# EAGLE schematic CleanSensorBoard (EAGLE 5.07)
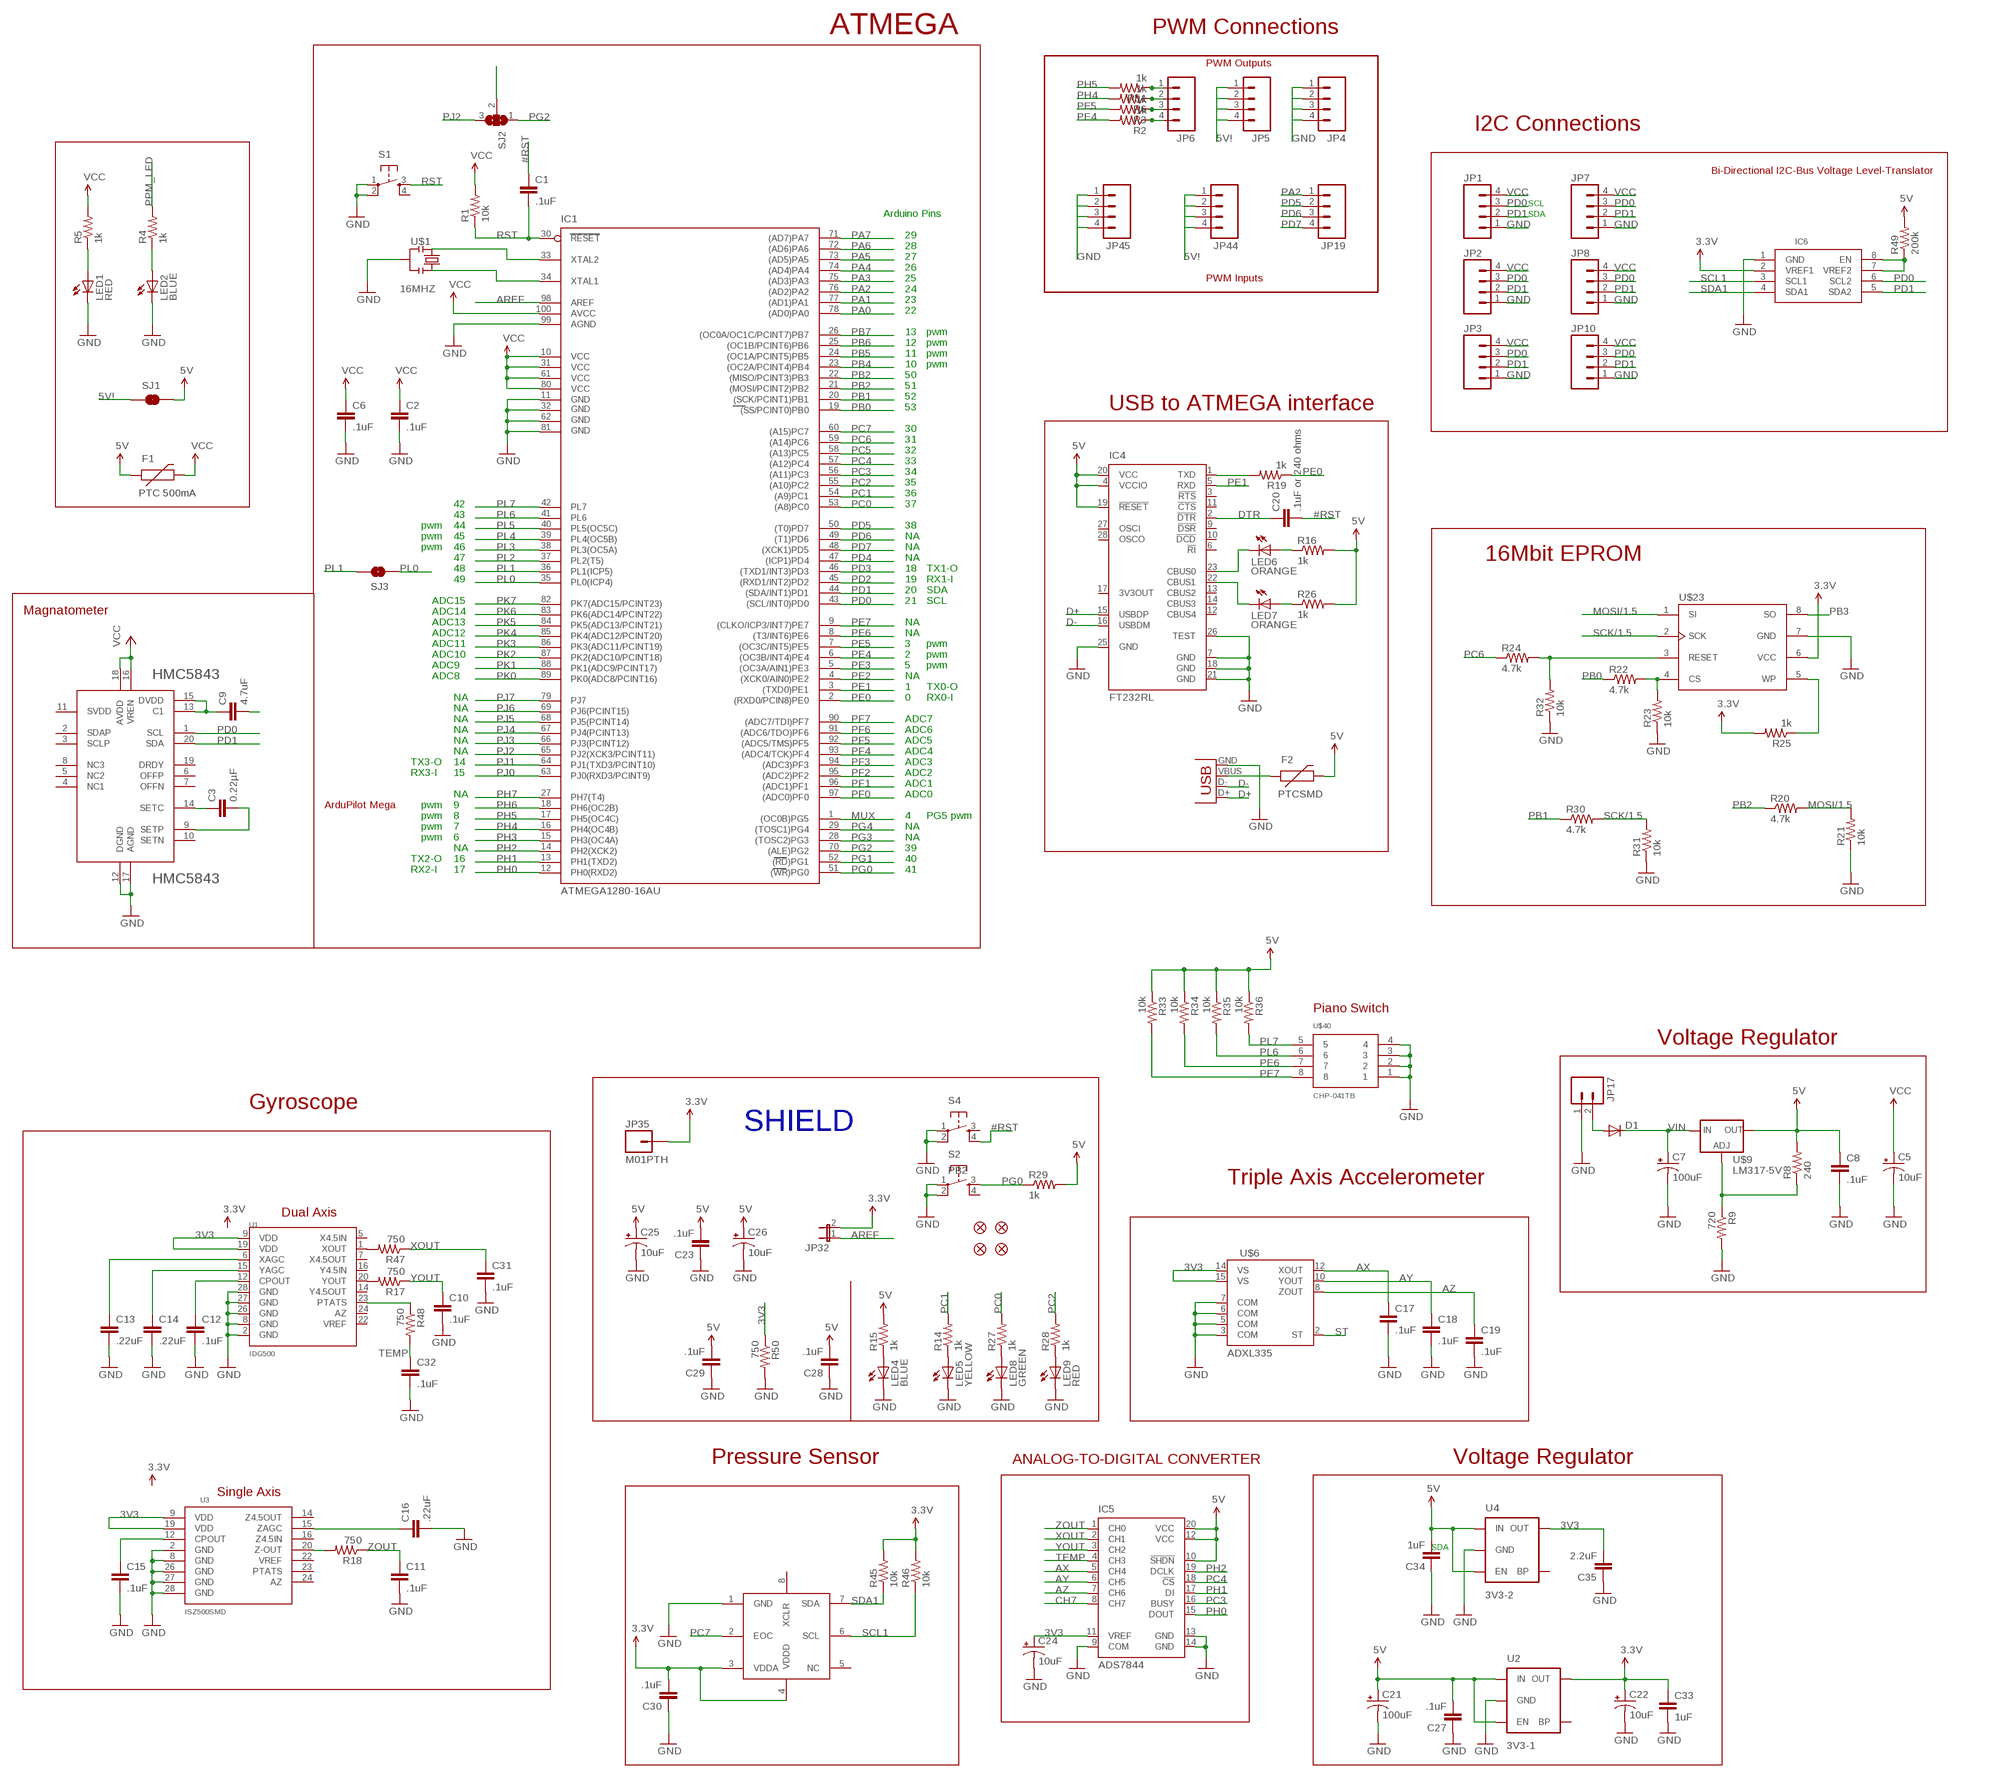
[diagram p0: schematic, sheet 1]

## Parts
C1  .1uF  CAP0402  [C0402]
C2  .1uF  CAP0402  [C0402]
C3  0.22µF  C-EUC0402  [C0402]
C5  10uF  CAP_POL1206  [EIA3216]
C6  .1uF  CAP0402  [C0402]
C7  100uF  CAP_POL3528  [EIA3528]
C8  .1uF  CAP0402  [C0402]
C9  4.7uF  CAP0402  [C0402]
C10  .1uF  CAP0402  [C0402]
C11  .1uF  CAP0402  [C0402]
C12  .1uF  CAP0402  [C0402]
C13  .22uF  CAP0402  [C0402]
C14  .22uF  CAP0402  [C0402]
C15  .1uF  CAP0402  [C0402]
C16  .22uF  CAP0402  [C0402]
C17  .1uF  CAP0402  [C0402]
C18  .1uF  CAP0402  [C0402]
C19  .1uF  CAP0402  [C0402]
C20  .1uF or 240 ohms  CAP0402  [C0402]
C21  100uF  CAP_POL3528  [EIA3528]
C22  10uF  CAP_POL1206  [EIA3216]
C23  .1uF  CAP0402  [C0402]
C24  10uF  CAP_POL1206  [EIA3216]
C25  10uF  CAP_POL1206  [EIA3216]
C26  10uF  CAP_POL1206  [EIA3216]
C27  .1uF  CAP0402  [C0402]
C28  .1uF  CAP0402  [C0402]
C29  .1uF  CAP0402  [C0402]
C30  .1uF  CAP0402  [C0402]
C31  .1uF  CAP0402  [C0402]
C32  .1uF  CAP0402  [C0402]
C33  1uF  CAP0402  [C0402]
C34  1uF  CAP0402  [C0402]
C35  2.2uF  CAP0402  [C0402]
D1  DIODESMA  [SMA-DIODE]
F1  PTC 500mA  PTCSMD  [PTC-1206]
F2  PTCSMD  [PTC-1206]
HMC5843  HMC5843  [LPCC-20]
IC1  ATMEGA1280-16AU  [TQFP100]
IC4  FT232RL  [SSOP28]
IC5  ADS7844  ADS8344U  [SSOP20BU]
IC6  PCA9306  [SOIC8]
JP1  M04PTH  [1X04]
JP2  M04PTH  [1X04]
JP3  M04PTH  [1X04]
JP4  M04PTH  [1X04]
JP5  M04PTH  [1X04]
JP6  M04PTH  [1X04]
JP7  M04PTH  [1X04]
JP8  M04PTH  [1X04]
JP9  FIDUCIAL1.5X3  [FIDUCIAL-1.5X3]
JP10  M04PTH  [1X04]
JP17  M02NG  [1X02]
JP19  M04PTH  [1X04]
JP32  JUMPER-2SMD-NO  [SJ_2S-NO]
JP35  M01PTH  [1X01]
JP41  FIDUCIAL1.5X3  [FIDUCIAL-1.5X3]
JP42  FIDUCIAL1.5X3  [FIDUCIAL-1.5X3]
JP43  FIDUCIAL1.5X3  [FIDUCIAL-1.5X3]
JP44  M04PTH  [1X04]
JP45  M04PTH  [1X04]
LED1  RED  LED0603  [LED-0603]
LED2  BLUE  LED0603  [LED-0603]
LED4  BLUE  LED0603  [LED-0603]
LED5  YELLOW  LED0603  [LED-0603]
LED6  ORANGE  LED0603  [LED-0603]
LED7  ORANGE  LED0603  [LED-0603]
LED8  GREEN  LED0603  [LED-0603]
LED9  RED  LED0603  [LED-0603]
R1  10k  RESISTOR0402  [C0402]
R2  1k  RESISTOR0402  [C0402]
R3  1k  RESISTOR0402  [C0402]
R4  1k  RESISTOR0402  [C0402]
R5  1k  RESISTOR0402  [C0402]
R6  1k  RESISTOR0402  [C0402]
R8  240  RESISTOR0402  [C0402]
R9  720  RESISTOR0402  [C0402]
R14  1k  RESISTOR0402  [C0402]
R15  1k  RESISTOR0402  [C0402]
R16  1k  RESISTOR0402  [C0402]
R17  750  RESISTOR0402  [C0402]
R18  750  RESISTOR0402  [C0402]
R19  1k  RESISTOR0402  [C0402]
R20  4.7k  RESISTOR0402  [C0402]
R21  10k  RESISTOR0402  [C0402]
R22  4.7k  RESISTOR0402  [C0402]
R23  10k  RESISTOR0402  [C0402]
R24  4.7k  RESISTOR0402  [C0402]
R25  1k  RESISTOR0402  [C0402]
R26  1k  RESISTOR0402  [C0402]
R27  1k  RESISTOR0402  [C0402]
R28  1k  RESISTOR0402  [C0402]
R29  1k  RESISTOR0402  [C0402]
R30  4.7k  RESISTOR0402  [C0402]
R31  10k  RESISTOR0402  [C0402]
R32  10k  RESISTOR0402  [C0402]
R33  10k  RESISTOR0402  [C0402]
R34  10k  RESISTOR0402  [C0402]
R35  10k  RESISTOR0402  [C0402]
R36  10k  RESISTOR0402  [C0402]
R45  10k  RESISTOR0402  [C0402]
R46  10k  RESISTOR0402  [C0402]
R47  750  RESISTOR0402  [C0402]
R48  750  RESISTOR0402  [C0402]
R49  200k  RESISTOR0402  [C0402]
R50  750  RESISTOR0402  [C0402]
R51  1k  RESISTOR0402  [C0402]
S1  TAC_SWITCHSMD  [TACTILE_SWITCH_SMD]
S2  TAC_SWITCHSMD  [TACTILE_SWITCH_SMD]
S4  TAC_SWITCHSMD  [TACTILE_SWITCH_SMD]
SJ1  SJ2  SOLDERJUMPERNC2  [SJ_2S]
SJ2  SOLDERJUMPER_2WAYS  [SJ_3]
SJ3  SOLDERJUMPERNC3  [SJ_2S-NOTRACE]
U1  IDG500  [SPARKFUN_IDG500]
U2  3V3-1  V_REG_LDOSMD  [SOT23-5]
U3  ISZ500SMD  [QFN-28_6X8]
U4  3V3-2  V_REG_LDOSMD  [SOT23-5]
U$1  16MHZ  RESONATORSMD  [RESONATOR-SMD]
U$6  ADXL335  ADXL330SMD  [LFCSP-16]
U$9  LM317-5V  V_REG_317SMD  [SOT223]
U$23  DF  ATMEL_DATA_FLASH  [SO08WIDE]
U$40  CHP-041TB  [CHP-041TB]
U$41  BMP085  [BMP085]
X1  USBSMD  [USB-MINIB]

## Nets
3.3V: C22.A(+) C30.2 C33.1 IC6.2(VREF1) JP32.2 JP35.1 R25.2 R45.2 R46.2 U2.5(OUT) U$23.6(VCC) U$41.3(VDDA) U$41.4(VDDD)
3V3: C24.A(+) C35.2 IC5.11(VREF) R50.1 U1.9(VDD) U1.19(VDD) U3.9(VDD) U3.19(VDD) U4.5(OUT) U$6.14(VS) U$6.15(VS)
5V: F2.2
5V!: JP5.1 JP5.2 JP5.3 JP5.4 JP44.1 JP44.2 JP44.3 JP44.4 SJ1.1
#RST: C1.1 C20.2 S4.4
AREF: IC1.98(AREF) JP32.1
AX: C17.1 IC5.5(CH4) U$6.12(XOUT)
AY: C18.1 IC5.6(CH5) U$6.10(YOUT)
AZ: C19.1 IC5.7(CH6) U$6.8(ZOUT)
CH7: IC5.8(CH7)
D+: IC4.15(USBDP) X1.D+
D-: IC4.16(USBDM) X1.D-
DTR: C20.1 IC4.2(!DTR)
DVDD: C9.1 HMC5843.13(C1) HMC5843.15(DVDD)
GND: C2.2 C5.C(-) C6.2 C7.C(-) C8.2 C9.2 C10.2 C11.2 C12.2 C13.2 C14.2 C15.2 C16.2 C17.2 C18.2 C19.2 C21.C(-) C22.C(-) C23.1 C24.C(-) C25.C(-) C26.C(-) C27.1 C28.1 C29.1 C30.1 C31.2 C32.2 C33.2 C34.1 C35.1 HMC5843.12(DGND) HMC5843.17(AGND) IC1.11(GND) IC1.32(GND1) IC1.62(GND2) IC1.81(GND3) IC1.99(AGND) IC4.7(GND) IC4.18(GND) IC4.21(GND) IC4.25(GND) IC4.26(TEST) IC5.9(COM) IC5.13(GND) IC5.14(GND) IC6.1(GND) JP1.1 JP2.1 JP3.1 JP4.1 JP4.2 JP4.3 JP4.4 JP7.1 JP8.1 JP10.1 JP17.1 JP45.1 JP45.2 JP45.3 JP45.4 LED1.C LED2.C LED4.C LED5.C LED8.C LED9.C R9.2 R21.1 R23.1 R31.1 R32.1 R50.2 S1.1 S1.2 S2.1 S2.2 S4.1 S4.2 U1.2(GND) U1.8(GND) U1.26(GND) U1.27(GND) U1.28(GND) U2.2(GND) U3.2(GND) U3.8(GND) U3.26(GND) U3.27(GND) U3.28(GND) U4.2(GND) U$1.2 U$6.3(COM) U$6.5(COM) U$6.6(COM) U$6.7(COM) U$23.7(GND) U$40.1 U$40.2 U$40.3 U$40.4 U$41.1(GND) X1.GND
MOSI/1.5: R20.2 R21.2 U$23.1(SI)
MUX: IC1.1((OC0B)PG5)
N$1: LED1.A R5.1
N$2: LED2.A R4.1
N$3: R8.1 R9.1 U$9.1(ADJ)
N$4: D1.A JP17.2
N$6: JP6.1 R51.1
N$7: JP6.2 R6.1
N$11: C3.1 HMC5843.14(SETC)
N$12: SJ2.2
N$13: LED4.A R15.1
N$14: LED5.A R14.1
N$15: LED6.A R16.1
N$16: IC4.1(TXD) R19.2
N$17: F2.1 X1.VBUS
N$18: R22.2 R23.2 U$23.4(CS)
N$19: R24.2 R32.2 U$23.3(RESET)
N$20: C3.2 HMC5843.9(SETP)
N$22: LED7.A R26.1
N$23: R17.2 U1.20(YOUT)
N$24: IC4.23(CBUS0) LED6.C
N$25: IC4.22(CBUS1) LED7.C
N$26: LED8.A R27.1
N$27: LED9.A R28.1
N$29: R47.2 U1.1(XOUT)
N$30: C12.1 U1.12(CPOUT)
N$31: C13.1 U1.6(XAGC)
N$32: C14.1 U1.15(YAGC)
N$33: C15.1 U3.12(CPOUT)
N$35: C16.1 U3.15(ZAGC)
N$37: R48.1 U1.23(PTATS)
N$39: R18.2 U3.20(Z-OUT)
N$41: IC6.7(VREF2) IC6.8(EN) R49.1
N$42: JP6.3 R3.1
N$43: JP6.4 R2.1
N$56: IC1.34(XTAL1) U$1.3
N$89: IC1.33(XTAL2) U$1.1
PA0: IC1.78((AD0)PA0)
PA1: IC1.77((AD1)PA1)
PA2: IC1.76((AD2)PA2) JP19.1
PA3: IC1.75((AD3)PA3)
PA4: IC1.74((AD4)PA4)
PA5: IC1.73((AD5)PA5)
PA6: IC1.72((AD6)PA6)
PA7: IC1.71((AD7)PA7)
PB0: IC1.19((SS/PCINT0)PB0) R22.1
PB1: IC1.20((SCK/PCINT1)PB1) R30.1
PB2: IC1.21((MOSI/PCINT2)PB2) IC1.22((MISO/PCINT3)PB3) R20.1
PB3: U$23.8(SO)
PB4: IC1.23((OC2A/PCINT4)PB4)
PB5: IC1.24((OC1A/PCINT5)PB5)
PB6: IC1.25((OC1B/PCINT6)PB6)
PB7: IC1.26((OC0A/OC1C/PCINT7)PB7)
PC0: IC1.53((A8)PC0) R27.2
PC1: IC1.54((A9)PC1) R14.2
PC2: IC1.55((A10)PC2) R28.2
PC3: IC1.56((A11)PC3) IC5.16(BUSY)
PC4: IC1.57((A12)PC4) IC5.18(!CS)
PC5: IC1.58((A13)PC5)
PC6: IC1.59((A14)PC6) R24.1
PC7: IC1.60((A15)PC7) U$41.2(EOC)
PD0: HMC5843.1(SCL) IC1.43((SCL/INT0)PD0) IC6.6(SCL2) JP1.3 JP2.3 JP3.3 JP7.3 JP8.3 JP10.3
PD1: HMC5843.20(SDA) IC1.44((SDA/INT1)PD1) IC6.5(SDA2) JP1.2 JP2.2 JP3.2 JP7.2 JP8.2 JP10.2
PD2: IC1.45((RXD1/INT2)PD2)
PD3: IC1.46((TXD1/INT3)PD3)
PD4: IC1.47((ICP1)PD4)
PD5: IC1.50((T0)PD7) JP19.2
PD6: IC1.49((T1)PD6) JP19.3
PD7: IC1.48((XCK1)PD5) JP19.4
PE0: IC1.2((RXD0/PCIN8)PE0) R19.1
PE1: IC1.3((TXD0)PE1) IC4.5(RXD)
PE2: IC1.4((XCK0/AIN0)PE2)
PE3: IC1.5((OC3A/AIN1)PE3)
PE4: IC1.6((OC3B/INT4)PE4) R2.2
PE5: IC1.7((OC3C/INT5)PE5) R3.2
PE6: IC1.8((T3/INT6)PE6) R34.2 U$40.7
PE7: IC1.9((CLKO/ICP3/INT7)PE7) R33.2 U$40.8
PF0: IC1.97((ADC0)PF0)
PF1: IC1.96((ADC1)PF1)
PF2: IC1.95((ADC2)PF2)
PF3: IC1.94((ADC3)PF3)
PF4: IC1.93((ADC4/TCK)PF4)
PF5: IC1.92((ADC5/TMS)PF5)
PF6: IC1.91((ADC6/TDO)PF6)
PF7: IC1.90((ADC7/TDI)PF7)
PG0: IC1.51((WR)PG0) R29.1 S2.3
PG1: IC1.52((RD)PG1)
PG2: IC1.70((ALE)PG2) SJ2.1
PG3: IC1.28((TOSC2)PG3)
PG4: IC1.29((TOSC1)PG4)
PH0: IC1.12(PH0(RXD2)) IC5.15(DOUT)
PH1: IC1.13(PH1(TXD2)) IC5.17(DI)
PH2: IC1.14(PH2(XCK2)) IC5.19(DCLK)
PH3: IC1.15(PH3(OC4A))
PH4: IC1.16(PH4(OC4B)) R6.2
PH5: IC1.17(PH5(OC4C)) R51.2
PH6: IC1.18(PH6(OC2B))
PH7: IC1.27(PH7(T4))
PJ0: IC1.63(PJ0(RXD3/PCINT9))
PJ1: IC1.64(PJ1(TXD3/PCINT10))
PJ2: IC1.65(PJ2(XCK3/PCINT11)) SJ2.3
PJ3: IC1.66(PJ3(PCINT12))
PJ4: IC1.67(PJ4(PCINT13))
PJ5: IC1.68(PJ5(PCINT14))
PJ6: IC1.69(PJ6(PCINT15))
PJ7: IC1.79(PJ7)
PK0: IC1.89(PK0(ADC8/PCINT16))
PK1: IC1.88(PK1(ADC9/PCINT17))
PK2: IC1.87(PK2(ADC10/PCINT18))
PK3: IC1.86(PK3(ADC11/PCINT19))
PK4: IC1.85(PK4(ADC12/PCINT20))
PK5: IC1.84(PK5(ADC13/PCINT21))
PK6: IC1.83(PK6(ADC14/PCINT22))
PK7: IC1.82(PK7(ADC15/PCINT23))
PL0: IC1.35(PL0(ICP4)) SJ3.1
PL1: IC1.36(PL1(ICP5)) SJ3.2
PL2: IC1.37(PL2(T5))
PL3: IC1.38(PL3(OC5A))
PL4: IC1.39(PL4(OC5B))
PL5: IC1.40(PL5(OC5C))
PL6: IC1.41(PL6) R35.2 U$40.6
PL7: IC1.42(PL7) R36.2 U$40.5
PPM_LED: R4.2
RST: C1.2 IC1.30(RESET) R1.1 S1.3
SCK/1.5: R30.2 R31.2 U$23.2(SCK)
SCL1: IC6.3(SCL1) R46.1 U$41.6(SCL)
SDA1: IC6.4(SDA1) R45.1 U$41.7(SDA)
ST: U$6.2(ST)
TEMP: C32.1 IC5.4(CH3) R48.2
VCC: C2.1 C5.A(+) C6.1 C8.1 C21.A(+) C23.2 C25.A(+) C26.A(+) C27.2 C28.2 C29.2 C34.2 F1.1 F1.2 HMC5843.16(VREN) HMC5843.18(AVDD) IC1.10(VCC) IC1.31(VCC1) IC1.61(VCC2) IC1.80(VCC3) IC1.100(AVCC) IC4.4(VCCIO) IC4.19(!RESET) IC4.20(VCC) IC5.10(!SHDN) IC5.12(VCC) IC5.20(VCC) JP1.4 JP2.4 JP3.4 JP7.4 JP8.4 JP10.4 R1.2 R5.2 R8.2 R15.2 R16.2 R26.2 R29.2 R33.1 R34.1 R35.1 R36.1 R49.2 SJ1.2 U2.1(IN) U2.3(EN) U4.1(IN) U4.3(EN) U$9.2(OUT) ; supply symbol labelled 5V
VIN: C7.A(+) D1.C U$9.3(IN)
WP: R25.1 U$23.5(WP)
XOUT: C31.1 IC5.2(CH1) R47.1
YOUT: C10.1 IC5.3(CH2) R17.1
ZOUT: C11.1 IC5.1(CH0) R18.1
Unconnected: HMC5843.2(SDAP) HMC5843.3(SCLP) HMC5843.4(NC1) HMC5843.5(NC2) HMC5843.6(OFFP) HMC5843.7(OFFN) HMC5843.8(NC3) HMC5843.10(SETN) HMC5843.11(SVDD) HMC5843.19(DRDY) IC4.3(!RTS) IC4.6(!RI) IC4.9(!DSR) IC4.10(!DCD) IC4.11(!CTS) IC4.12(CBUS4) IC4.13(CBUS2) IC4.14(CBUS3) IC4.17(3V3OUT) IC4.27(OSCI) IC4.28(OSCO) S1.4 S2.4 S4.3 U1.5(X4.5IN) U1.7(X4.5OUT) U1.14(Y4.5OUT) U1.16(Y4.5IN) U1.22(VREF) U1.24(AZ) U2.4(BP) U3.14(Z4.5OUT) U3.16(Z4.5IN) U3.22(VREF) U3.23(PTATS) U3.24(AZ) U4.4(BP) U$41.5(NC) U$41.8(XCLR)

## Notes on the sheet
- ATMEGA | PWM Connections
- PWM Outputs
- I2C Connections
- Bi-Directional I2C-Bus Voltage Level-Translator
- SCL
- Arduino Pins | SDA
- 29
- 28
- 27
- 26
- 25 | PWM Inputs
- 24
- 23
- 22
- 13 | pwm
- 12 | pwm
- 11 | pwm
- 10 | pwm
- 50
- 51
- 52
- 53 | USB to ATMEGA interface
- 30
- 31
- 32
- 33
- 34
- 35
- 36
- 42 | 37
- 43
- pwm | 44 | 38
- pwm | 45 | NA
- pwm | 46 | NA
- 47 | NA | 16Mbit EPROM
- 48 | 18 | TX1-O
- 49 | 19 | RX1-I
- 20 | SDA
- ADC15 | 21 | SCL
- Magnatometer | ADC14
- ADC13 | NA
- ADC12 | NA
- ADC11 | 3 | pwm
- ADC10 | 2 | pwm
- ADC9 | 5 | pwm
- ADC8 | NA
- 1 | TX0-O
- NA | 0 | RX0-I
- NA
- NA | ADC7
- SCL | NA | ADC6
- SDA | NA | ADC5
- NA | ADC4
- TX3-O | 14 | ADC3
- RX3-I | 15 | ADC2
- ADC1
- NA | ADC0
- ArduPilot Mega | pwm | 9
- pwm | 8 | 4 | PG5 pwm
- pwm | 7 | NA
- pwm | 6 | NA
- NA | 39
- TX2-O | 16 | 40
- RX2-I | 17 | 41
- Piano Switch
- Voltage Regulator
- Gyroscope
- SHIELD
- Triple Axis Accelerometer
- Dual Axis
- Pressure Sensor | ANALOG-TO-DIGITAL CONVERTER | Voltage Regulator
- Single Axis
- SDA

## Library data of the parts
C1 C2 C6 C8-C20 C23 C27-C35 = DIYdrones3:CAP: Capacitor Standard 0603 ceramic capacitor, and 0.1" leaded capacitor.
C3 = rcl:C-EU: CAPACITOR, European symbol
C5 C7 C21 C22 C24-C26 = DIYdrones3:CAP_POL: Capacitor Polarized These are standard SMD and PTH capacitors. Normally 10uF, 47uF, and 100uF in electrolytic and tantalum varieties. Always verify the external diameter of the through hole cap, it varies with capacity, voltage, and manufacturer. The EIA devices should be standard.
D1 = DIYdrones3:DIODE: Diode These are standard reverse protection diodes and small signal diodes. SMA package can handle up to about 1A. SOD-323 can handle about 200mA. What the SOD-323 package when ordering, there are some mfgs out there that are 5-pin packages.
F1 F2 = DIYdrones3:PTC: Resettable Fuse PTC Resettable Fuse. Spark Fun Electronics SKU : COM-08357
HMC5843 = hmc5843:HMC5843
IC1 = atmel-2010:ATMEGA*: MICROCONTROLLER 64/128/256 Kbytes FLASH 4 Kbytes EEPROM 8 Kbytes SRAM 86 General Purpose I/O pins 12-channels16-bit PWM 4 x Serial USARTs 16-channels 10-bit A/D
IC4 = ftdichip:FT232R: Source: http://www.ftdichip.com/Documents/DataSheets/DS_FT232R_v104.pdf
IC5 = burr-brown:ADS8344: 16-Bit, 8-Channel Serial Output Sampling ADC
IC6 = DIYdrones:PCA9306: I2C Level translator. Digi-Key part: 568-4215-1-ND By Jordi Munoz
JP1-JP8 JP10 JP19 JP44 JP45 = SparkFun:M04: Header 4 Standard 4-pin 0.1" header. Use with straight break away headers (SKU : PRT-00116), right angle break away headers (PRT-00553), swiss pins (PRT-00743), machine pins (PRT-00117), and female headers (PRT-00115). Molex polarized connector foot print use with SKU : PRT-08231 with associated crimp pins and housings.
JP9 JP41-JP43 = SparkFun:FIDUCIAL: Fiducial Alignment Points Various fiducial points for machine vision alignment.
JP17 = SparkFunv2:M02NG
JP32 = DIYdrones3:JUMPER-2: Jumper Basic 0.1" spaced jumper. Use with breakaway headers.
JP35 = DIYdrones3:M01: Header 1 Standard 1-pin 0.1" header. Use with straight break away headers (SKU : PRT-00116), right angle break away headers (PRT-00553), swiss pins (PRT-00743), machine pins (PRT-00117), and female headers (PRT-00115).
LED1 LED2 LED4-LED9 = DIYdrones3:LED: LEDs Standard schematic elements and footprints for 5mm, 3mm, 1206, and 0603 sized LEDs. 5mm - Spark Fun Electronics SKU : COM-00529 (and others)
R1-R6 R8 R9 R14-R36 R45-R51 = DIYdrones3:RESISTOR: Resistor Basic schematic elements and footprints for 0603, 1206, and PTH 1/10th watt (small) resistors.
S1 S2 S4 = DIYdrones3:TAC_SWITCH: Momentary Switch Button commonly used for reset or general input. Spark Fun Electronics SKU : COM-00097
SJ1 SJ3 = DIYdrones3:SOLDERJUMPER: Solder Jumper Standard SMD solder jumper. Used to automate production. Two varients : Normally Open and Normally Closed are the same, but have different paste layers. NC will have a large amount of paste and should jumper during reflow.
SJ2 = DIYdrones3:SOLDERJUMPER_2WAY: Solder Jumper 2 way solder jumper
U1 = SparkFun:IDG500
U2 U4 = SparkFun:V_REG_LDO: Voltage Regulator LDO Standard 150mA LDO voltage regulator in SOT-23 layout. Micrel part MIC5205. BP (by-pass) pin is used to lower output noise with 470pF cap.
U3 = SparkFun:ISZ500: ISZ500 Single axis gyro
U$1 = DIYdrones3:RESONATOR: Resonator Small SMD resonator. This is the itty bitty 10/20MHz resonators with built in caps. CSTCE10M0G55 and CSTCE20M0V53. Footprint has been reviewed closely but hasn't been tested yet.
U$6 = DIYdrones3:ADXL330: Triple Axis Accelerometer Analog Devices ADXL330 +/-3g 2.4V-5.25V Analog output. Spark Fun Electronics SKU : COM-00730. Center pad paste layer has been reduced to avoid shorting.
U$9 = DIYdrones3:V_REG_317: Voltage Regulator Standard LM317 adjustable voltage regulator. AOI (Adjust Output Input). Google 'LM317 Calculator' for easy to use app to get the two resistor values needed. 240/720 for 5V output. 240/390 for 3.3V output. Spark Fun Electronics SKU : COM-00527
U$23 = DIYdrones3:ATMEL_DATA_FLASH: 16Mbit EEPROM DataFlash Footprint needs touching up. Spark Fun Electronics SKU : COM-00301
U$40 = DIYdrones:CHP-041TB: By Jordi Munoz, for DIYDrones.com (3DRRobotics LLC).
U$41 = SparkFun:BMP085
X1 = DIYdrones3:USB: USB Connectors USB-B-PTH is fully proven SKU : PRT-00139 USB-miniB is fully proven SKU : PRT-00587 USB-A-PCB is untested. USB-A-H is throughly reviewed, but untested. Spark Fun Electronics SKU : PRT-00437 USB-B-SMT is throughly reviewed, but untested. Needs silkscreen touching up. USB-A-S has not been used/tested USB-MB-H has not been used/tested